# Altium schematic sheet eMMC.SchDoc
size A4; DocumentNumber: 8; SheetNumber: 8; SheetTotal: 15
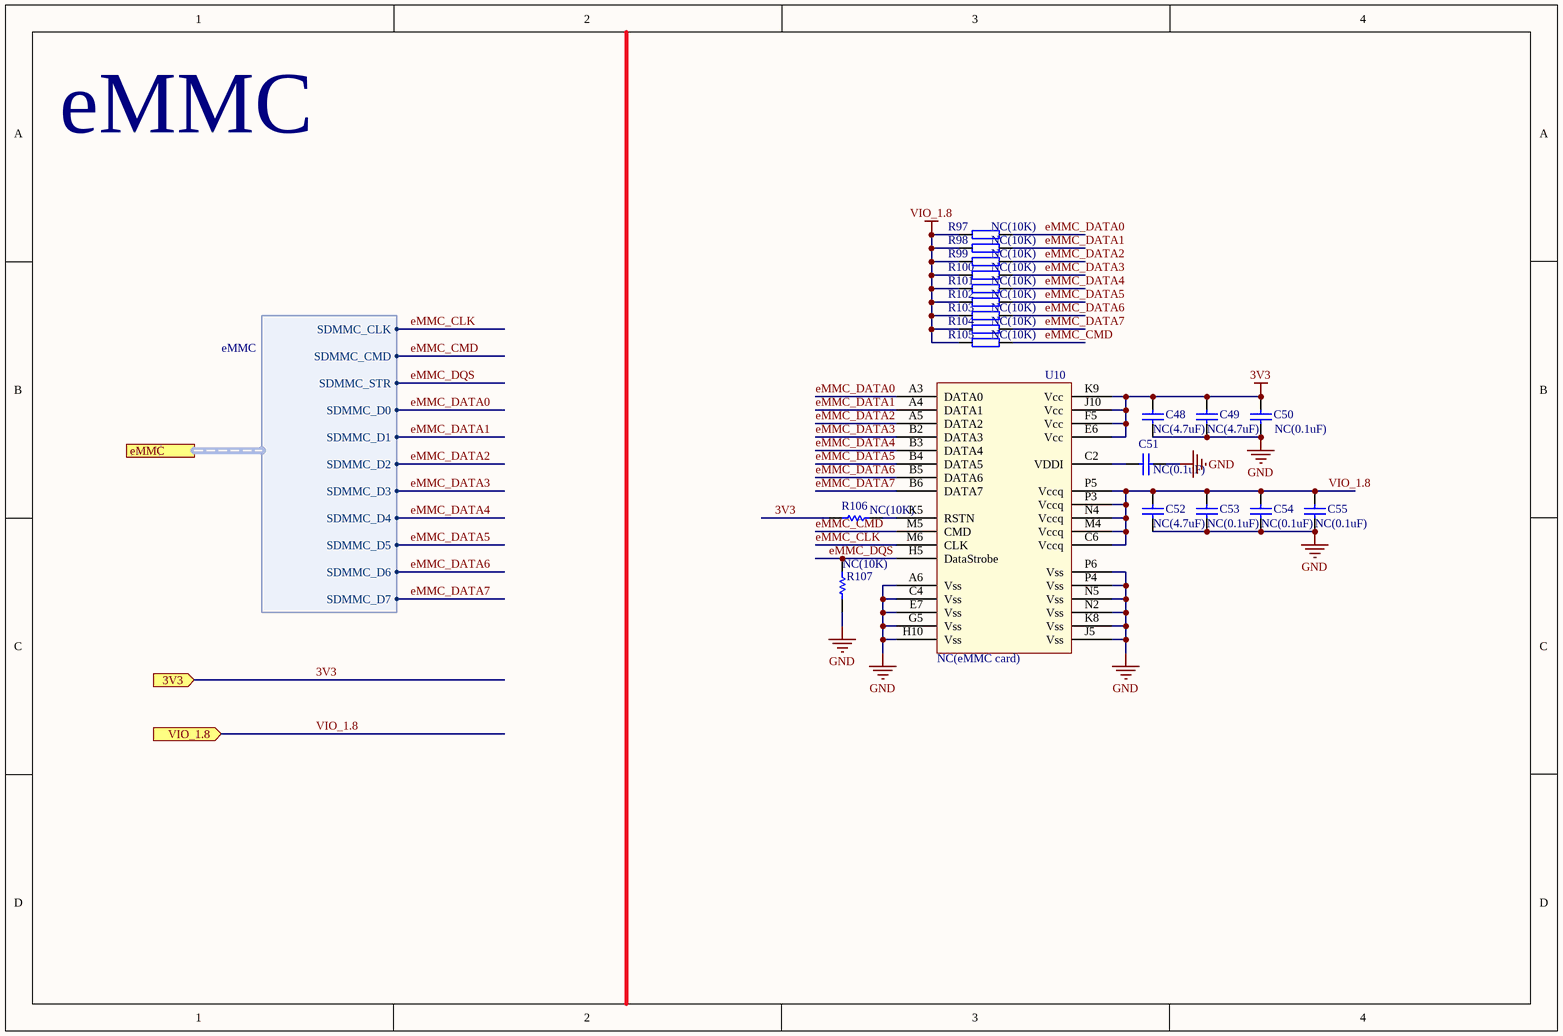
[diagram p0: eMMC.SchDoc]

## Parts
C48  NC(4.7uF)  [0402_C]
C49  NC(4.7uF)  [0402_C]
C50  NC(0.1uF)  [0402_C]
C51  NC(0.1uF)  [0402_C]
C52  NC(4.7uF)  [0402_C]
C53  NC(0.1uF)  [0402_C]
C54  NC(0.1uF)  [0402_C]
C55  NC(0.1uF)  [0402_C]
R97  NC(10K)  [0402]
R98  NC(10K)  [0402]
R99  NC(10K)  [0402]
R100  NC(10K)  [0402]
R101  NC(10K)  [0402]
R102  NC(10K)  [0402]
R103  NC(10K)  [0402]
R104  NC(10K)  [0402]
R105  NC(10K)  [0402]
R106  NC(10K)  [0402]
R107  NC(10K)  [0402]
U10  NC(eMMC card)  [WFBGA-153-11.5x13x0.8mm]

## Ports
3V3 (in), eMMC (harness eMMC), VIO_1.8 (in)

## Harnesses
eMMC: SDMMC_CLK, SDMMC_CMD, SDMMC_STR, SDMMC_D1, SDMMC_D0, SDMMC_D2, SDMMC_D3, SDMMC_D4, SDMMC_D5, SDMMC_D6, SDMMC_D7

## Nets
3V3: C48.2 C49.1 C50.1 R106.2 U10.E6(Vcc) U10.F5(Vcc) U10.J10(Vcc) U10.K9(Vcc) ; port 3V3
GND: C48.1 C49.2 C50.2 C51.1 C52.1 C53.2 C54.2 C55.2 R107.2 U10.A6(Vss) U10.C4(Vss) U10.E7(Vss) U10.G5(Vss) U10.H10(Vss) U10.J5(Vss) U10.K8(Vss) U10.N2(Vss) U10.N5(Vss) U10.P4(Vss) U10.P6(Vss)
VIO_1.8: C52.2 C53.1 C54.1 C55.1 R97.2 R98.2 R99.2 R100.2 R101.2 R102.2 R103.2 R104.2 R105.2 U10.C6(Vccq) U10.M4(Vccq) U10.N4(Vccq) U10.P3(Vccq) U10.P5(Vccq) ; port VIO_1.8
eMMC_CLK: U10.M6(CLK) ; port eMMC.SDMMC_CLK
eMMC_CMD: R105.1 U10.M5(CMD) ; port eMMC.SDMMC_CMD
eMMC_DATA0: R97.1 U10.A3(DATA0) ; port eMMC.SDMMC_D0
eMMC_DATA1: R98.1 U10.A4(DATA1) ; port eMMC.SDMMC_D1
eMMC_DATA2: R99.1 U10.A5(DATA2) ; port eMMC.SDMMC_D2
eMMC_DATA3: R100.1 U10.B2(DATA3) ; port eMMC.SDMMC_D3
eMMC_DATA4: R101.1 U10.B3(DATA4) ; port eMMC.SDMMC_D4
eMMC_DATA5: R102.1 U10.B4(DATA5) ; port eMMC.SDMMC_D5
eMMC_DATA6: R103.1 U10.B5(DATA6) ; port eMMC.SDMMC_D6
eMMC_DATA7: R104.1 U10.B6(DATA7) ; port eMMC.SDMMC_D7
eMMC_DQS: R107.1 U10.H5(DataStrobe) ; port eMMC.SDMMC_STR
NetC51_2: C51.2 U10.C2(VDDI)
NetR106_1: R106.1 U10.K5(RSTN)

## Notes on the sheet
- eMMC

## Library data of the parts
C48-C55 = Cap: Capacitor; Published: 8-Jun-2000; LatestRevisionDate: 17-Jul-2002; LatestRevisionNote: Re-released for DXP Platform.; PackageReference: RAD-0.3; Publisher: Altium Limited; PackageDescription: Radial Cap, Thru-Hole; 2 Leads; 0.3 in Pin Spacing
R97-R105 = RES
R106 R107 = Res1: Resistor; Published: 8-Jun-2000; LatestRevisionDate: 17-Jul-2002; LatestRevisionNote: Re-released for DXP Platform.; PackageReference: AXIAL-0.3; Publisher: Altium Limited; PackageDescription: Axial Device, Thru-Hole; 2 Leads; 0.3 in Pin Spacing
U10 = KLM8G1GETF-B041